# EAGLE design polarplotter allegro v4 (EAGLE 5.07)
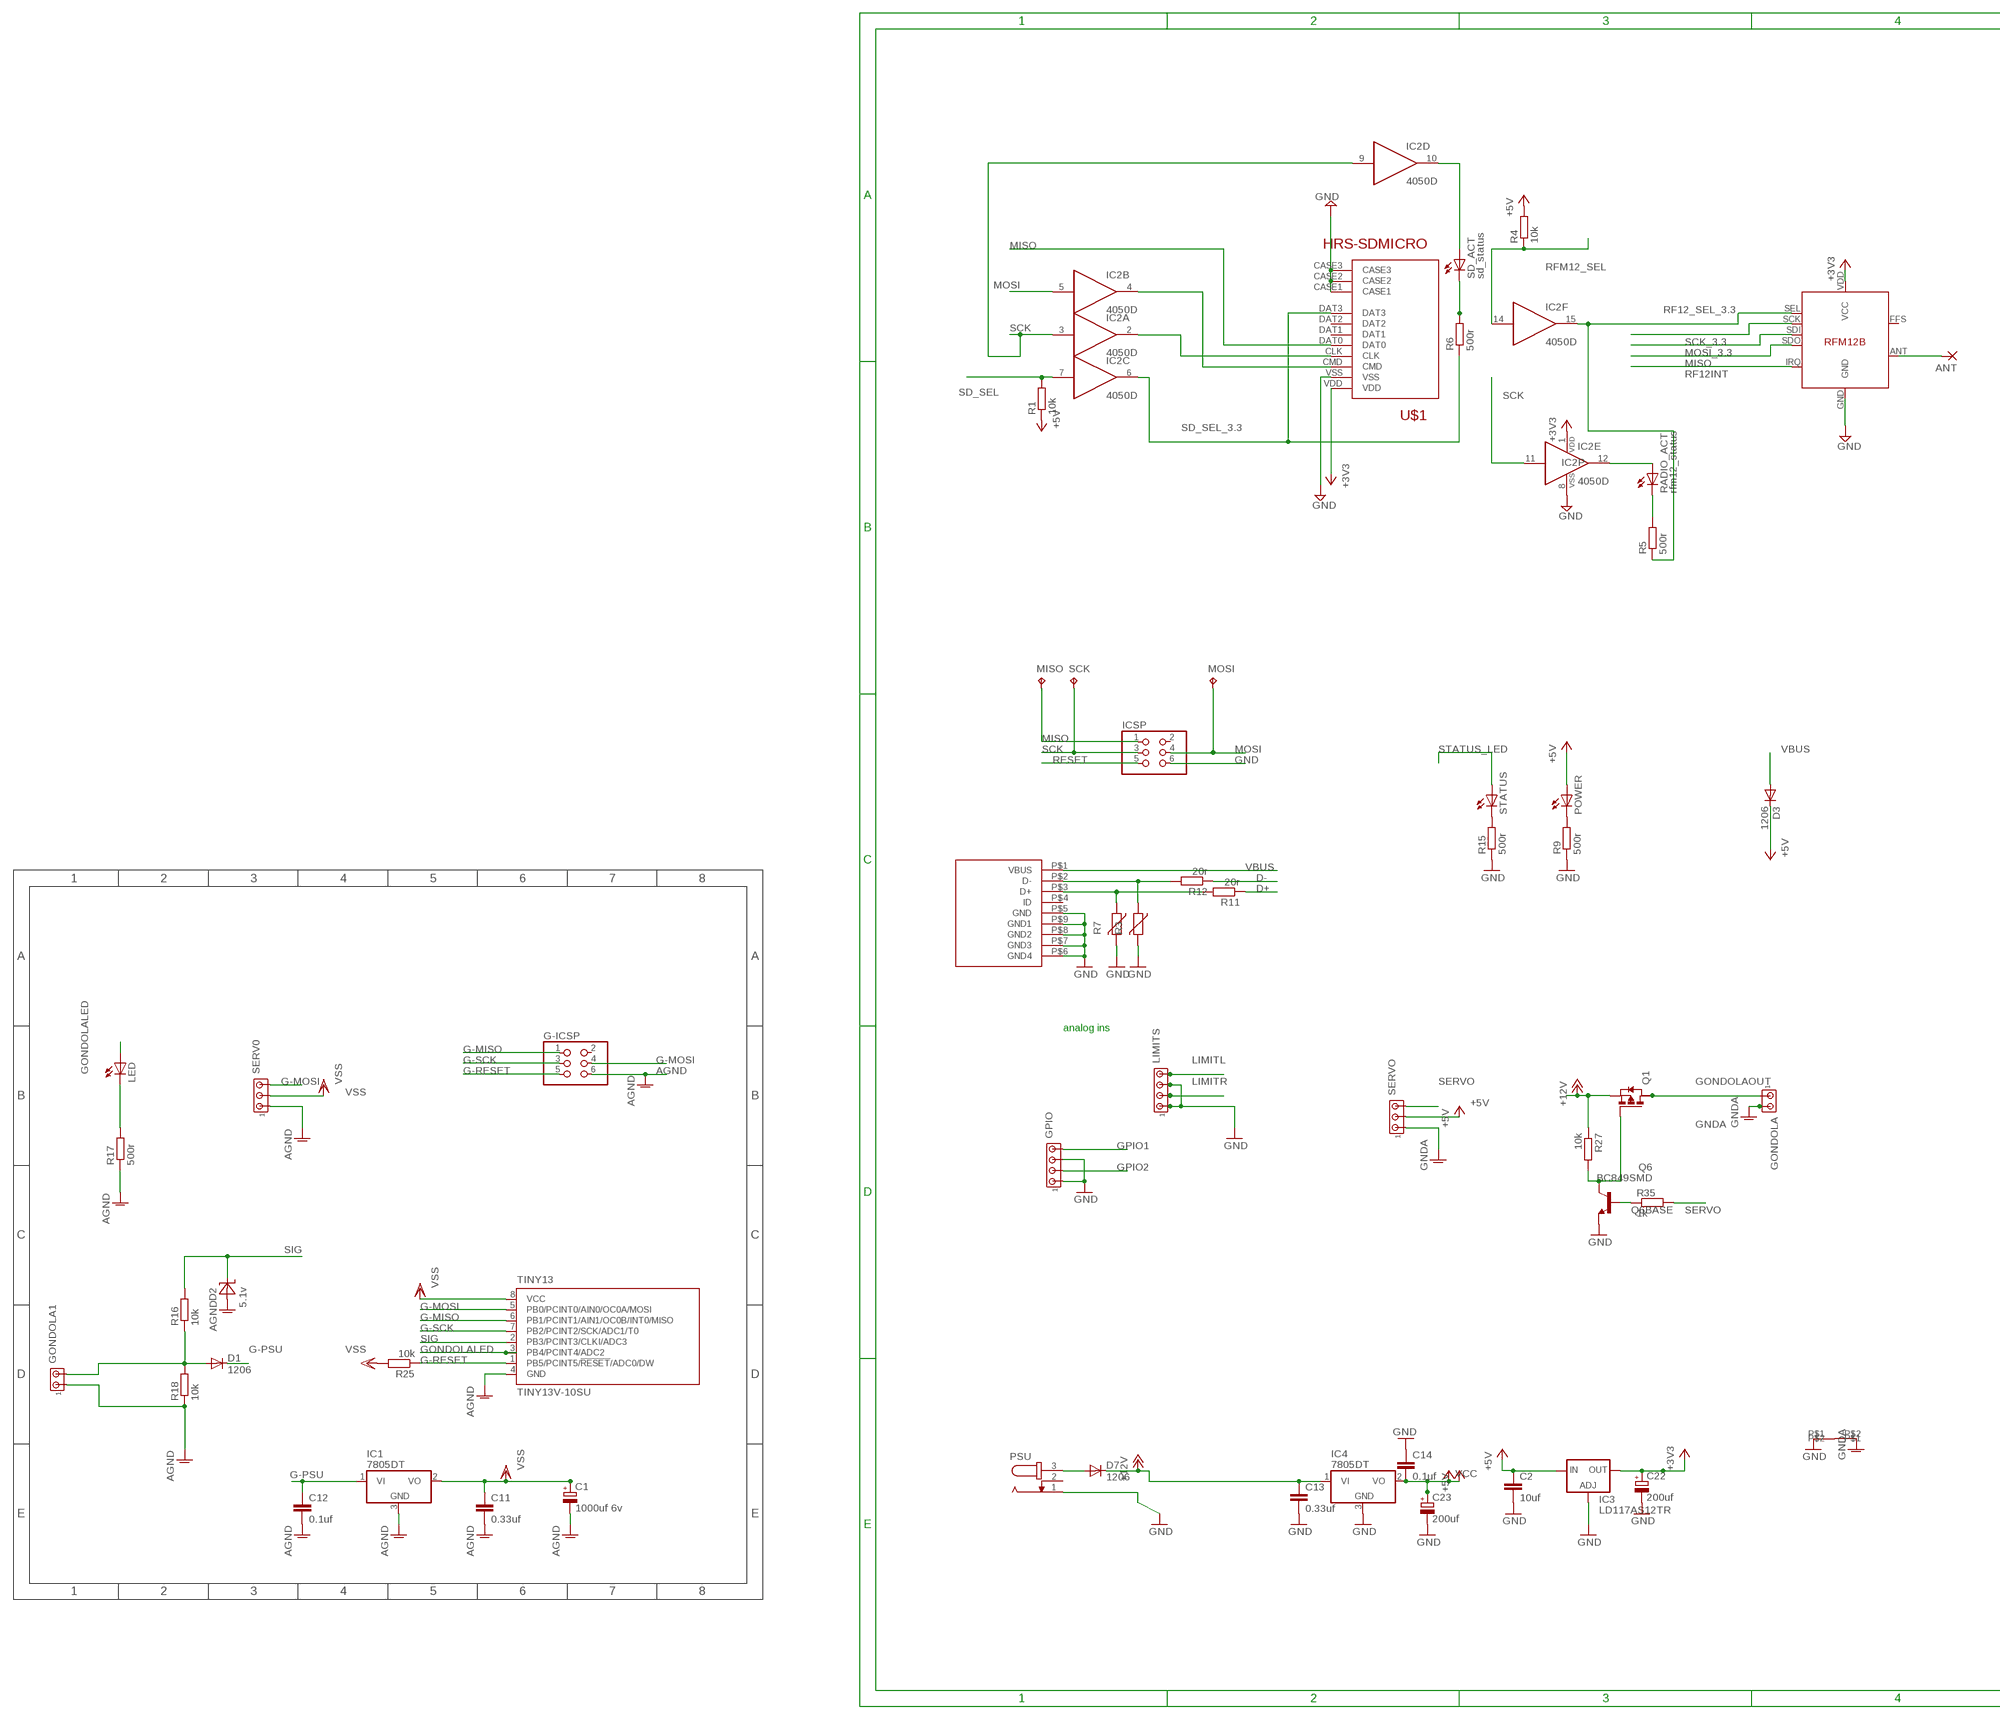
[diagram p0: schematic, sheet 1, part 1 of 2]
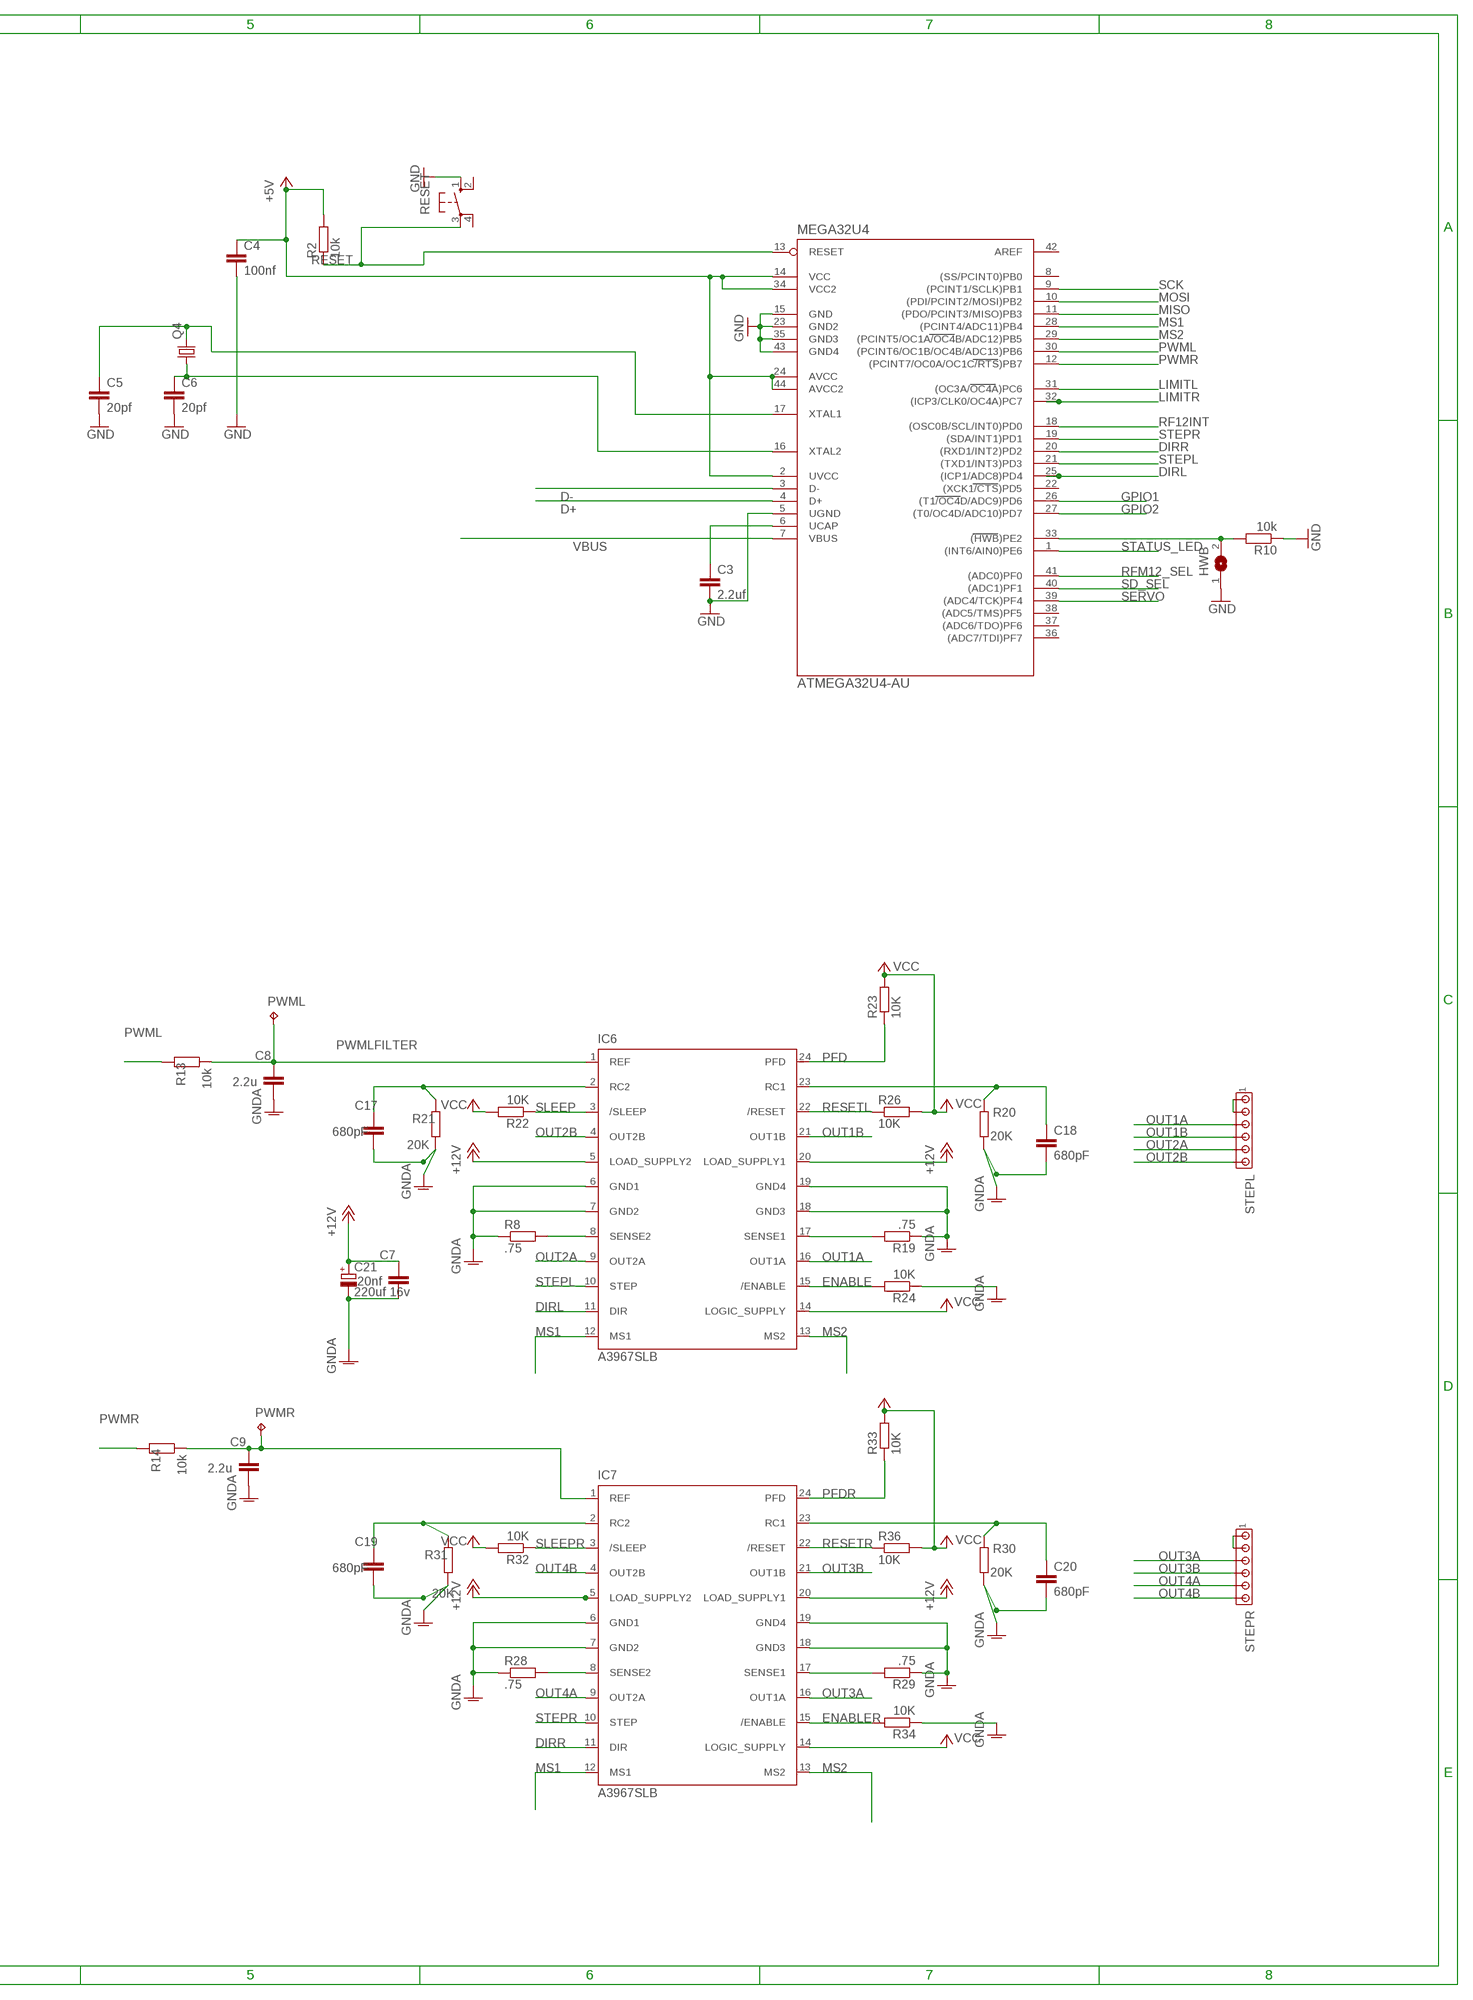
[diagram p1: schematic, sheet 1, part 2 of 2]

## Parts
ANT  1,6/0,8  [1,6/0,8]
C1  1000uf 6v  CPOL-EU153CLV-0810  [153CLV-0810]
C2  10uf  C-EUC1206  [C1206]
C3  2.2uf  C-EUC1206  [C1206]
C4  100nf  C-EUC1206  [C1206]
C5  20pf  C-EUC1206  [C1206]
C6  20pf  C-EUC1206  [C1206]
C7  20nf  C-EUC1206  [C1206]
C8  2.2u  C-EUC1206  [C1206]
C9  2.2u  C-EUC1206  [C1206]
C11  0.33uf  C-EUC1206  [C1206]
C12  0.1uf  C-EUC1206  [C1206]
C13  0.33uf  C-EUC1206  [C1206]
C14  0.1uf  C-EUC1206  [C1206]
C17  680pF  C-EUC1206  [C1206]
C18  680pF  C-EUC1206  [C1206]
C19  680pF  C-EUC1206  [C1206]
C20  680pF  C-EUC1206  [C1206]
C21  220uf 16v  CPOL-EU153CLV-0810  [153CLV-0810]
C22  200uf  CPOL-EU153CLV-0505  [153CLV-0505]
C23  200uf  CPOL-EU153CLV-0505  [153CLV-0505]
D1  1206  DIODE-GF1  [GF1]
D2  5.1v  1206ZENER  [C1206]
D3  1206  DIODE-GF1  [GF1]
D7  1206  DIODE-GF1  [GF1]
G-ICSP  PINHD-2X3  [2X03]
GONDOLA  MTA02-100  [10X02MTA]
GONDOLA1  MTA02-100  [10X02MTA]
GPIO  MTA04-100  [10X04MTA]
HWB  SJ  [SJ]
IC1  7805DT  [TO252]
IC2  4050D  [SO16]
IC3  LD117AS12TR  [SOT223]
IC4  7805DT  [TO252]
IC6  A3967SLB  [SO24W]
IC7  A3967SLB  [SO24W]
ICSP  PINHD-2X3  [2X03]
LED  LEDSMT1206  [1206]
LIMITS  MTA04-100  [10X04MTA]
MEGA32U4  ATMEGA32U4-AU  [TQFP44]
MISO  TPB1,27  [B1,27]
MOSI  TPB1,27  [B1,27]
POWER  LEDSMT1206  [1206]
PSU  JACK-PLUG1  [SPC4078]
PWML  TPB1,27  [B1,27]
PWMR  TPB1,27  [B1,27]
Q1  PMOSSOT223  [SOT223]
Q4  CRYSTALCTS406  [CTS406]
Q6  BC849SMD  [SOT23-BEC]
R1  10k  R-EU_R1206  [R1206]
R2  10k  R-EU_R1206  [R1206]
R3  VARISTORCN1206  [CT/CN1206]
R4  10k  R-EU_R1206  [R1206]
R5  500r  R-EU_R1206  [R1206]
R6  500r  R-EU_R1206  [R1206]
R7  VARISTORCN1206  [CT/CN1206]
R8  .75  R-EU_R1206  [R1206]
R9  500r  R-EU_R1206  [R1206]
R10  10k  R-EU_R1206  [R1206]
R11  20r  R-EU_R1206  [R1206]
R12  20r  R-EU_R1206  [R1206]
R13  10k  R-EU_R1206  [R1206]
R14  10k  R-EU_R1206  [R1206]
R15  500r  R-EU_R1206  [R1206]
R16  10k  R-EU_R1206  [R1206]
R17  500r  R-EU_R1206  [R1206]
R18  10k  R-EU_R1206  [R1206]
R19  .75  R-EU_R1206  [R1206]
R20  20K  R-EU_R1206  [R1206]
R21  20K  R-EU_R1206  [R1206]
R22  10K  R-EU_R1206  [R1206]
R23  10K  R-EU_R1206  [R1206]
R24  10K  R-EU_R1206  [R1206]
R25  10k  R-EU_R1206  [R1206]
R26  10K  R-EU_R1206  [R1206]
R27  10k  R-EU_M1206  [M1206]
R28  .75  R-EU_R1206  [R1206]
R29  .75  R-EU_R1206  [R1206]
R30  20K  R-EU_R1206  [R1206]
R31  20K  R-EU_R1206  [R1206]
R32  10K  R-EU_R1206  [R1206]
R33  10K  R-EU_R1206  [R1206]
R34  10K  R-EU_R1206  [R1206]
R35  1k  R-EU_M1206  [M1206]
R36  10K  R-EU_R1206  [R1206]
RADIO_ACT  rfm12_status  LEDSMT1206  [1206]
RESET  10-XX  [B3F-10XX]
RFM12  RFM12B  [RFM12B]
SCK  TPB1,27  [B1,27]
SD_ACT  sd_status  LEDSMT1206  [1206]
SERV0  MTA03-100  [10X03MTA]
SERVO  MTA03-100  [10X03MTA]
STATUS  LEDSMT1206  [1206]
STEPL  MTA06-100  [10X06MTA]
STEPR  MTA06-100  [10X06MTA]
TINY13  TINY13V-10SU  [8S2]
U$1  HRS-SDMICRO  [HRS-MICROSD]
U$4  SHORT  [SHORT]
USB  USB  [USB]

## Nets
+3V3: C22.+ IC2.1(P:VDD) IC3.4(OUT) RFM12.VDD(VCC) U$1.VDD
+5V: C2.1 C4.1 C14.2 C23.+ D3.C IC3.3(IN) IC4.2(VO) IC6.14(LOGIC_SUPPLY) IC7.14(LOGIC_SUPPLY) MEGA32U4.2(UVCC) MEGA32U4.14(VCC) MEGA32U4.24(AVCC) MEGA32U4.34(VCC2) MEGA32U4.44(AVCC2) POWER.A R1.1 R2.2 R4.2 R22.2 R23.2 R26.2 R32.2 R33.2 R36.2 SERVO.2 ; supply symbol labelled VCC
+12V [power]: C7.1 C13.1 C21.+ D7.C IC4.1(VI) IC6.5(LOAD_SUPPLY2) IC6.20(LOAD_SUPPLY1) IC7.5(LOAD_SUPPLY2) IC7.20(LOAD_SUPPLY1) Q1.3(S) R27.1
AGND [power]: C1.- C11.2 C12.2 D2.ANODE(A) G-ICSP.6 GONDOLA1.1 IC1.3(GND) R17.1 R18.1 SERV0.1 TINY13.4(GND)
D+: MEGA32U4.4(D+) R11.1
D-: MEGA32U4.3(D-) R12.1
DIRL: IC6.11(DIR) MEGA32U4.25((ICP1/ADC8)PD4)
DIRR: IC7.11(DIR) MEGA32U4.20((RXD1/INT2)PD2)
ENABLE: IC6.15(/ENABLE) R24.2
ENABLER: IC7.15(/ENABLE) R34.2
G-MISO: G-ICSP.1 TINY13.6(PB1/PCINT1/AIN1/OC0B/INT0/MISO)
G-MOSI: G-ICSP.4 SERV0.3 TINY13.5(PB0/PCINT0/AIN0/OC0A/MOSI)
G-PSU: C12.1 D1.C IC1.1(VI)
G-RESET: G-ICSP.5 R25.1 TINY13.1(PB5/PCINT5/!RESET!/ADC0/DW)
G-SCK: G-ICSP.3 TINY13.7(PB2/PCINT2/SCK/ADC1/T0)
GND [power]: C2.2 C3.2 C4.2 C5.2 C6.2 C13.2 C14.1 C22.- C23.- GPIO.1 GPIO.3 HWB.1 IC2.8(P:VSS) IC3.1(ADJ) IC4.3(GND) ICSP.6 LIMITS.1 LIMITS.3 MEGA32U4.5(UGND) MEGA32U4.15(GND) MEGA32U4.23(GND2) MEGA32U4.35(GND3) MEGA32U4.43(GND4) PSU.1 Q6.E R3.2 R7.2 R9.1 R10.1 R15.1 RESET.1(S) RFM12.GND U$1.CASE1 U$1.CASE2 U$1.CASE3 U$1.VSS U$4.P$1 USB.P$5(GND) USB.P$6(GND4) USB.P$7(GND3) USB.P$8(GND2) USB.P$9(GND1)
GNDA [power]: C7.2 C8.2 C9.2 C17.2 C18.2 C19.2 C20.2 C21.- GONDOLA.2 IC6.6(GND1) IC6.7(GND2) IC6.18(GND3) IC6.19(GND4) IC7.6(GND1) IC7.7(GND2) IC7.18(GND3) IC7.19(GND4) R8.1 R19.1 R20.1 R21.1 R24.1 R28.1 R29.1 R30.1 R31.1 R34.1 SERVO.1 U$4.P$2
GONDOLALED: LED.A TINY13.3(PB4/PCINT4/ADC2)
GONDOLAOUT [power]: GONDOLA.1 Q1.2(D)
GPIO1: GPIO.4 MEGA32U4.26((T1/OC4D/ADC9)PD6)
GPIO2: GPIO.2 MEGA32U4.27((T0/OC4D/ADC10)PD7)
LIMITL: LIMITS.4 MEGA32U4.31((OC3A/OC4A)PC6)
LIMITR: LIMITS.2 MEGA32U4.32((ICP3/CLK0/OC4A)PC7)
MISO: ICSP.1 MEGA32U4.11((PDO/PCINT3/MISO)PB3) MISO.TP RFM12.SDO U$1.DAT0
MOSI: IC2.5(B:I) ICSP.4 MEGA32U4.10((PDI/PCINT2/MOSI)PB2) MOSI.TP
MOSI_3.3: IC2.4(B:O) RFM12.SDI U$1.CMD
MOTORSUPPLY [power]: STEPL.5 STEPL.6
MOTORSUPPLY1 [power]: STEPR.5 STEPR.6
MS1: IC6.12(MS1) IC7.12(MS1) MEGA32U4.28((PCINT4/ADC11)PB4)
MS2: IC6.13(MS2) IC7.13(MS2) MEGA32U4.29((PCINT5/OC1A/OC4B/ADC12)PB5)
N$1: HWB.2 MEGA32U4.33((HWB)PE2) R10.2
N$3: IC2.12(E:O) RADIO_ACT.A
N$4: D1.A GONDOLA1.2 R16.1 R18.2
N$5: IC2.10(D:O) SD_ACT.A
N$6: R3.1 R12.2 USB.P$2(D-)
N$7: R15.2 STATUS.C
N$8: C3.1 MEGA32U4.6(UCAP)
N$9: ANT.1(P) RFM12.ANT
N$10: C6.1 MEGA32U4.16(XTAL2) Q4.1
N$11: C5.1 MEGA32U4.17(XTAL1) Q4.3
N$12: R7.1 R11.2 USB.P$3(D+)
N$13: POWER.C R9.2
N$14: D7.A PSU.3
N$15: R5.2 RADIO_ACT.C
N$18: R6.2 SD_ACT.C
N$22: IC6.8(SENSE2) R8.2
N$23: IC6.17(SENSE1) R19.2
N$24: C17.1 IC6.2(RC2) R21.2
N$25: C18.1 IC6.23(RC1) R20.2
N$26: IC7.8(SENSE2) R28.2
N$27: IC7.17(SENSE1) R29.2
N$28: C19.1 IC7.2(RC2) R31.2
N$29: C20.1 IC7.23(RC1) R30.2
N$34: LED.C R17.2
OUT1A: IC6.16(OUT1A) STEPL.4
OUT1B: IC6.21(OUT1B) STEPL.3
OUT2A: IC6.9(OUT2A) STEPL.2
OUT2B: IC6.4(OUT2B) STEPL.1
OUT3A: IC7.16(OUT1A) STEPR.4
OUT3B: IC7.21(OUT1B) STEPR.3
OUT4A: IC7.9(OUT2A) STEPR.2
OUT4B: IC7.4(OUT2B) STEPR.1
PFD: IC6.24(PFD) R23.1
PFDR: IC7.24(PFD) R33.1
PWML: MEGA32U4.30((PCINT6/OC1B/OC4B/ADC13)PB6) R13.2
PWMLFILTER: C8.1 IC6.1(REF) PWML.TP R13.1
PWMR: MEGA32U4.12((PCINT7/OC0A/OC1C/RTS)PB7) R14.2
PWMRFILTER: C9.1 IC7.1(REF) PWMR.TP R14.1
Q6BASE: Q6.B R35.1
Q6COLLECTOR: Q1.1(G) Q6.C R27.2
RESET: ICSP.5 MEGA32U4.13(RESET) R2.1 RESET.3(P)
RESETL: IC6.22(/RESET) R26.1
RESETR: IC7.22(/RESET) R36.1
RF12_SEL_3.3: IC2.15(F:O) R5.1 RFM12.SEL
RF12INT: MEGA32U4.18((OSC0B/SCL/INT0)PD0) RFM12.IRQ
RFM12_SEL: IC2.14(F:I) MEGA32U4.41((ADC0)PF0) R4.1
SCK: IC2.3(A:I) IC2.9(D:I) IC2.11(E:I) ICSP.3 MEGA32U4.9((PCINT1/SCLK)PB1) SCK.TP
SCK_3.3: IC2.2(A:O) RFM12.SCK U$1.CLK
SD_SEL: IC2.7(C:I) MEGA32U4.40((ADC1)PF1) R1.2
SD_SEL_3.3: IC2.6(C:O) R6.1 U$1.DAT3
SERVO: MEGA32U4.39((ADC4/TCK)PF4) R35.2 SERVO.3
SIG: D2.CATHODE(C) R16.2 TINY13.2(PB3/PCINT3/CLKI/ADC3)
SLEEP: IC6.3(/SLEEP) R22.1
SLEEPR: IC7.3(/SLEEP) R32.1
STATUS_LED: MEGA32U4.1((INT6/AIN0)PE6) STATUS.A
STEPL: IC6.10(STEP) MEGA32U4.21((TXD1/INT3)PD3)
STEPR: IC7.10(STEP) MEGA32U4.19((SDA/INT1)PD1)
VBUS [power]: D3.A MEGA32U4.7(VBUS) USB.P$1(VBUS)
VSS: C1.+ C11.1 IC1.2(VO) R25.2 SERV0.2 TINY13.8(VCC)
Unconnected: G-ICSP.2 ICSP.2 MEGA32U4.8((SS/PCINT0)PB0) MEGA32U4.22((XCK1/CTS)PD5) MEGA32U4.36((ADC7/TDI)PF7) MEGA32U4.37((ADC6/TDO)PF6) MEGA32U4.38((ADC5/TMS)PF5) MEGA32U4.42(AREF) PSU.2 Q1.4(D2) RESET.2(S1) RESET.4(P1) RFM12.FFS U$1.DAT1 U$1.DAT2 USB.P$4(ID)

## Notes on the sheet
- analog ins

## Library data of the parts
ANT = JeeLabs:1,6/0,8: THROUGH-HOLE PAD
C1 C21 = matt rcl:CPOL-EU: POLARIZED CAPACITOR, European symbol
C2 C7-C9 C11-C14 C17-C20 = resistor:C-EU: CAPACITOR, European symbol
C3-C6 = matt rcl:C-EU: CAPACITOR, European symbol
C22 C23 = rcl:CPOL-EU: POLARIZED CAPACITOR, European symbol
D1 D3 D7 = matt diode:DIODE-: DIODE
D2 = matt diode:1206ZENER
G-ICSP ICSP = pinhead:PINHD-2X3: PIN HEADER
GONDOLA GONDOLA1 = matt con-amp:MTA02-100: AMP connector
GPIO LIMITS = matt con-amp:MTA04-100: AMP connector
HWB = jumper:SJ: SMD solder JUMPER
IC1 IC4 = linear:78*: Positive VOLTAGE REGULATOR Source: http://cache.national.com/ds/LM/LM78L05.pdf http://www.fairchildsemi.com/ds/LM/LM7805.pdf
IC2 = 40xx:4050: Hex non-inverting BUFFER
IC3 = v-reg:LD117A?*: Low drop fixed and adjustable positive voltage regulators 1 A Source: http://www.st.com/stonline/products/literature/ds/7194/ld1117axx.pdf
IC6 IC7 = Allegro:A3967SLB: ANALOG DEVICES
LED POWER RADIO_ACT SD_ACT STATUS = matt led:LED: LED OSRAM: - CHIPLED LG R971, LG N971, LY N971, LG Q971, LY Q971, LO R971, LY R971 LH N974, LH R974 LS Q976, LO Q976, LY Q976 LO Q996 - Hyper CHIPLED LW Q18S LB Q993, LB Q99A, LB R99A - SideLED LS A670, LO A670, LY A670, LG A670, LP A670 LB A673, LV A673, LT A673, LW A673 LH A674 LY A675 LS A676, LA A676, LO A676, LY A676, LW A676 LS A679, LY A679, LG A679 - Hyper Micro SIDELED® LS Y876, LA Y876, LO Y876, LY Y876 LT Y87S - SmartLED LW L88C, LW L88S LB L89C, LB L89S, LG L890 LS L89K, LO L89K, LY L89K LS L896, LA L896, LO L896, LY L896 - TOPLED LS T670, LO T670, LY T670, LG T670, LP T670 LSG T670, LSP T670, LSY T670, LOP T670, LYG T670 LG T671, LOG T671, LSG T671 LB T673, LV T673, LT T673, LW T673 LH T674 LS T676, LA T676, LO T676, LY T676, LB T676, LH T676, LSB T676, LW T676 LB T67C, LV T67C, LT T67C, LS T67K, LO T67K, LY T67K, LW E67C LS E67B, LA E67B, LO E67B, LY E67B, LB E67C, LV E67C, LT E67C LW T67C LS T679, LY T679, LG T679 LS T770, LO T770, LY T770, LG T770, LP T770 LB T773, LV T773, LT T773, LW T773 LH T774 LS E675, LA E675, LY E675, LS T675 LS T776, LA T776, LO T776, LY T776, LB T776 LHGB T686 LT T68C, LB T68C - Hyper Mini TOPLED® LB M676 - Mini TOPLED Santana® LG M470 LS M47K, LO M47K, LY M47K Source: http://www.osram.convergy.de LUXEON: - LUMILED® LXK2-PW12-R00, LXK2-PW12-S00, LXK2-PW14-U00, LXK2-PW14-V00 LXK2-PM12-R00, LXK2-PM12-S00, LXK2-PM14-U00 LXK2-PE12-Q00, LXK2-PE12-R00, LXK2-PE12-S00, LXK2-PE14-T00, LXK2-PE14-U00 LXK2-PB12-K00, LXK2-PB12-L00, LXK2-PB12-M00, LXK2-PB14-N00, LXK2-PB14-P00, LXK2-PB14-Q00 LXK2-PR12-L00, LXK2-PR12-M00, LXK2-PR14-Q00, LXK2-PR14-R00 LXK2-PD12-Q00, LXK2-PD12-R00, LXK2-PD12-S00 LXK2-PH12-R00, LXK2-PH12-S00 LXK2-PL12-P00, LXK2-PL12-Q00, LXK2-PL12-R00 Source: www.luxeon.com KINGBRIGHT: KA-3528ASYC Source: www.kingbright.com
MEGA32U4 = mega32U4:ATMEGA32U4-AU
MISO MOSI PWML PWMR SCK = testpad:TP: Test pad
PSU = con-jack:JACK-PLUG: DC POWER JACK Power Jack, DC, Right Angle, Through Hole, Rated 5A at 16VDC, PC Terminals Distributor: Farnell (www.Farnell.de) Drawing: 84N1161.pdf / 84N1162.pdf Manufacturer: SPC Technology (www.spctechnology.com) Type: SPC4077 / SPC 4078
Q1 = zetex:PMOSSOT223: MOS FET
Q4 = crystal:CRYSTAL: CRYSTAL
Q6 = matt transistor-npn:BC849*: NPN Transistor
R1 R2 R4-R6 R9-R12 R15-R18 R25 = matt rcl:R-EU_: RESISTOR, European symbol
R3 R7 = varistor:VARISTOR: VARISTOR
R8 R13 R14 R19-R24 R26 R28-R34 R36 = rcl:R-EU_: RESISTOR, European symbol
R27 R35 = resistor:R-EU_: RESISTOR, European symbol
RESET = switch-omron:10-XX: OMRON SWITCH
RFM12 = lh-library:RFM12B
SERV0 SERVO = matt con-amp:MTA03-100: AMP connector
STEPL STEPR = matt con-amp:MTA06-100: AMP connector
TINY13 = atmel:TINY13: 8-bit AVR Microcontroller with 1K Bytes In-System Programmable Flash Source: http://www.atmel.com/dyn/resources/prod_documents/2535S.pdf; MPN: ATTINY13V-10SU; OC_FARNELL: 9171584; OC_NEWARK: 96K6524
U$1 = matt:HRS-SDMICRO
U$4 = matt:SHORT
USB = matt:USB

## Net classes
1 power: width 3 mm
2 medpower: width 1 mm

## Board
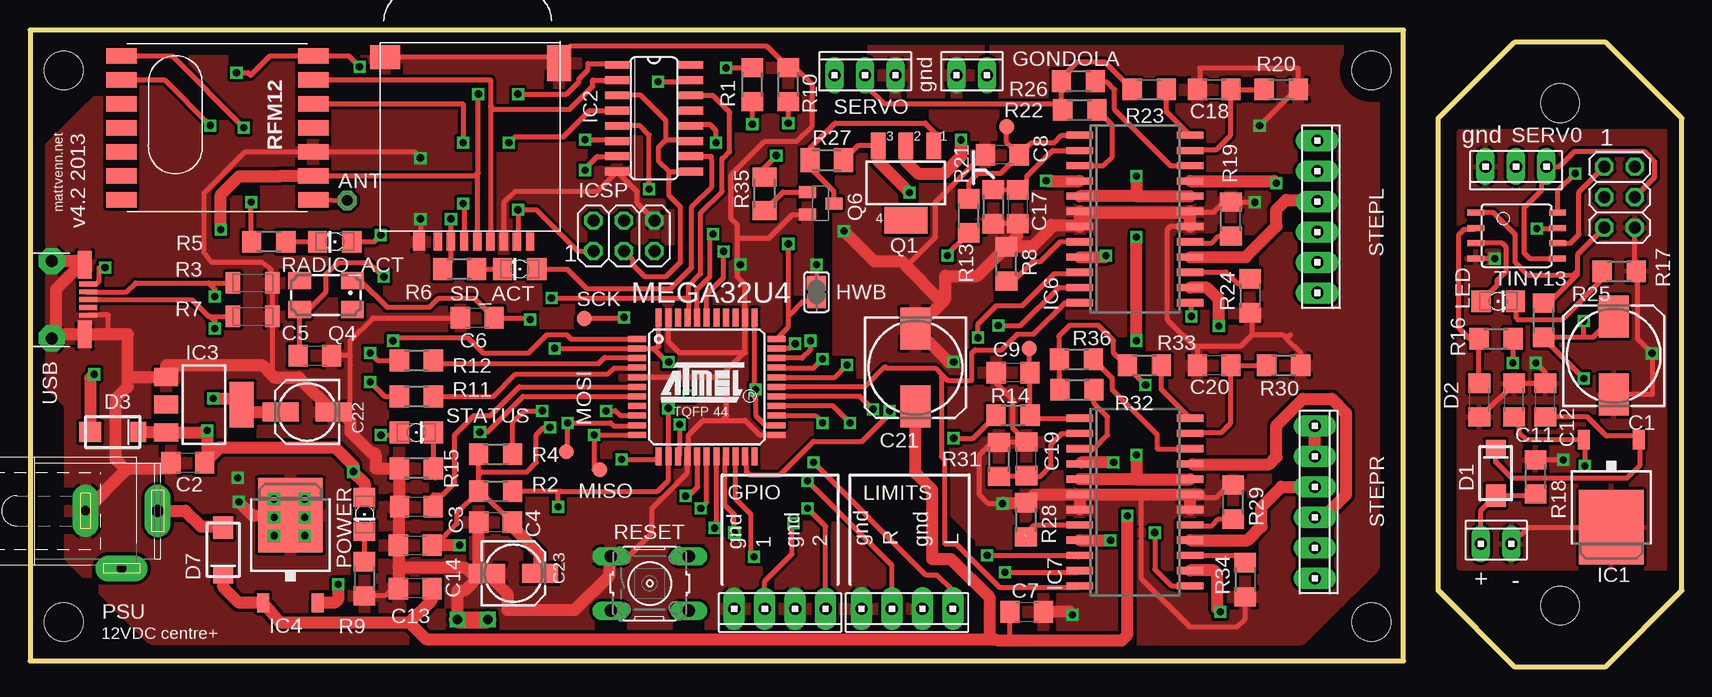
[diagram p2: board, top side]
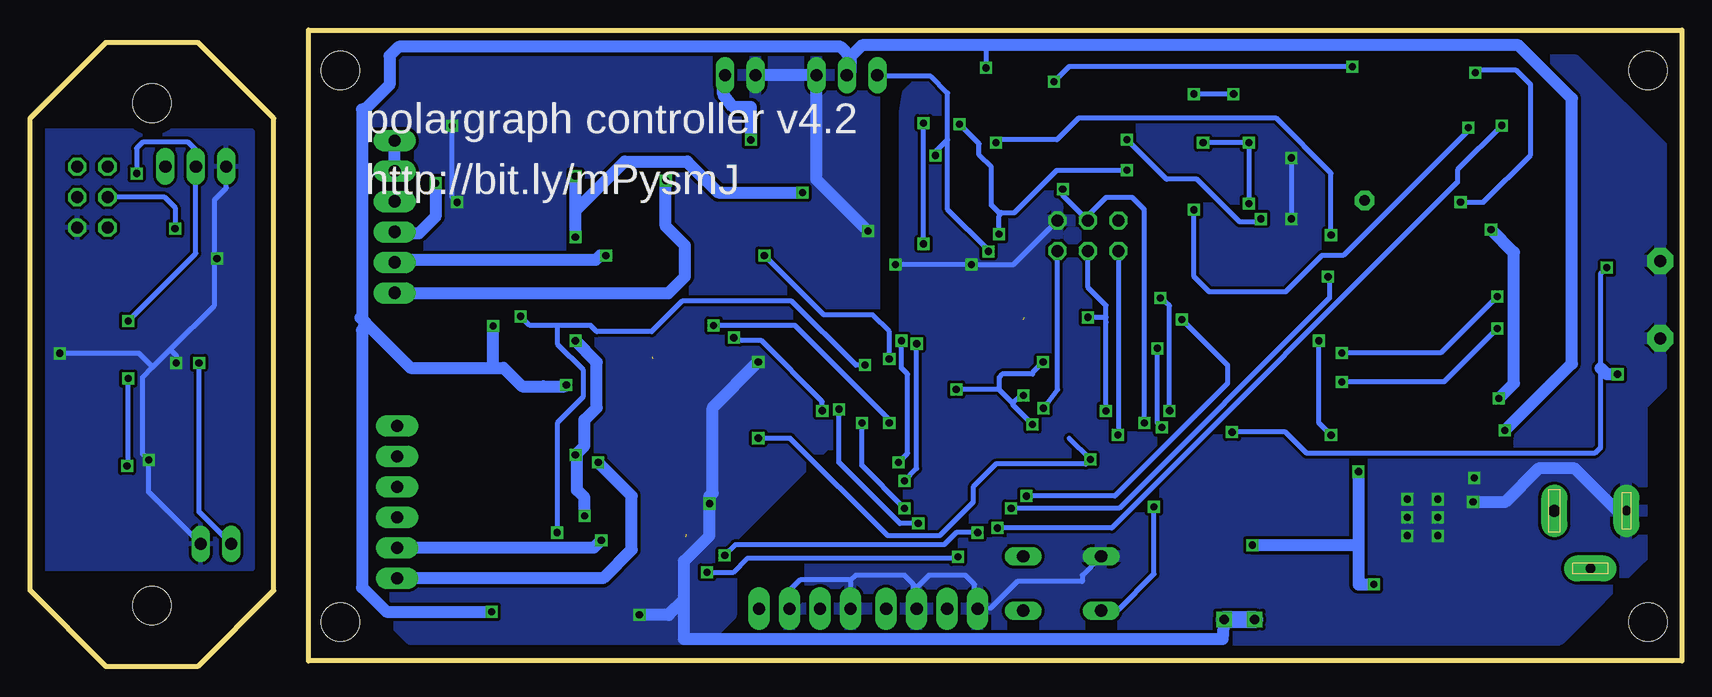
[diagram p3: board, bottom side, seen from below]

Size 137.7 x 53.09 mm. Coordinates in mm from the lower left corner, seen from the top.
Outline: 0,0.48 114.49,0.48 114.49,53.09 0,53.09 0,0.48
Outline: 117.38,45.72 123.73,52.07 131.35,52.07 137.7,45.72 137.7,6.35 131.35,0 123.73,0 117.38,6.35 117.38,45.72
Copper layers (1*16): Top 0.035mm / dielectric 1.5mm / Bottom 0.035mm
Design rules "default *": minimum track width 10mil, minimum drill 24mil, track to track 8mil, track to pad 8mil, pad to pad 8mil, via to via 8mil, smd to smd 8mil, copper to edge 40mil, drill to drill 8mil, minimum pad ring 10mil, minimum via ring 8mil, stop-mask expansion 4mil, vias tented up to drill 25mil, thermal gap 10mil
Holes 3.2 mm at 2.81,49.73 2.81,3.73 111.81,3.73 111.81,49.73 127.54,46.99 127.54,5.08

### Footprints (pad centres in the part's own frame; a part is rotated, then mirrored left to right if it is on the bottom)
1,6/0,8 = drill 0.9 pad 1.6 octagon: 1 0,0
153CLV-0810 = smd 3.5 x 2.5: + 3.25,0; - -3.25,0
C1206 = smd 1.6 x 1.8: 1 -1.4,0; 2 1.4,0
153CLV-0505 = smd 3 x 1.6: + 2.2,0; - -2.2,0
GF1 = smd 1.85 x 1.68: A 1.87,0 | smd 1.32 x 1.68: C -2.12,0
C1206' = smd 1.6 x 1.8: ANODE -1.4,0; CATHODE 1.4,0
2X03 = drill 1.016 octagon: 1 -2.54,-1.27; 2 -2.54,1.27; 3 0,-1.27; 4 0,1.27; 5 2.54,-1.27; 6 2.54,1.27
10X02MTA = drill 1.016 long: 1 1.27,0; 2 -1.27,0
10X04MTA = drill 1.016 pad 1.778 long: 1 3.81,0; 2 1.27,0; 3 -1.27,0; 4 -3.81,0
SJ = smd 1.168 x 1.6: 1 -0.762,0; 2 0.762,0
TO252 = smd 1 x 1.6: 1 -2.28,-4.8; 2 2.28,-4.8 | smd 5.4 x 6.2: 3 0,2.5
SO16 = smd 0.66 x 2.032: 1 -4.445,-3.073; 2 -3.175,-3.073; 3 -1.905,-3.073; 4 -0.635,-3.073; 5 0.635,-3.073; 6 1.905,-3.073; 7 3.175,-3.073; 8 4.445,-3.073; 9 4.445,3.073; 10 3.175,3.073; 11 1.905,3.073; 12 0.635,3.073; 13 -0.635,3.073; 14 -1.905,3.073; 15 -3.175,3.073; 16 -4.445,3.073
SOT223 = smd 1.5 x 2: 1 -2.3,-3.15; 2 0,-3.15; 3 2.3,-3.15 | smd 3.8 x 2: 4 0,3.15
SO24W = smd 0.6 x 2.2: 1 -6.985,-4.6; 2 -5.715,-4.6; 3 -4.445,-4.6; 4 -3.175,-4.6; 5 -1.905,-4.6; 6 -0.635,-4.6; 7 0.635,-4.6; 8 1.905,-4.6; 9 3.175,-4.6; 10 4.445,-4.6; 11 5.715,-4.6; 12 6.985,-4.6; 13 6.985,4.6; 14 5.715,4.6; 15 4.445,4.6; 16 3.175,4.6; 17 1.905,4.6; 18 0.635,4.6; 19 -0.635,4.6; 20 -1.905,4.6; 21 -3.175,4.6; 22 -4.445,4.6; 23 -5.715,4.6; 24 -6.985,4.6
1206 = smd 1.6 x 1.803: A -1.422,0; C 1.422,0
TQFP44 = smd 1.5 x 0.5: 1 -5.8,4; 2 -5.8,3.2; 3 -5.8,2.4; 4 -5.8,1.6; 5 -5.8,0.8; 6 -5.8,0; 7 -5.8,-0.8; 8 -5.8,-1.6; 9 -5.8,-2.4; 10 -5.8,-3.2; 11 -5.8,-4; 23 5.8,-4; 24 5.8,-3.2; 25 5.8,-2.4; 26 5.8,-1.6; 27 5.8,-0.8; 28 5.8,0; 29 5.8,0.8; 30 5.8,1.6; 31 5.8,2.4; 32 5.8,3.2; 33 5.8,4 | smd 0.5 x 1.5: 12 -4,-5.8; 13 -3.2,-5.8; 14 -2.4,-5.8; 15 -1.6,-5.8; 16 -0.8,-5.8; 17 0,-5.8; 18 0.8,-5.8; 19 1.6,-5.8; 20 2.4,-5.8; 21 3.2,-5.8; 22 4,-5.8; 34 4,5.8; 35 3.2,5.8; 36 2.4,5.8; 37 1.6,5.8; 38 0.8,5.8; 39 0,5.8; 40 -0.8,5.8; 41 -1.6,5.8; 42 -2.4,5.8; 43 -3.2,5.8; 44 -4,5.8
B1,27 = smd 1.27 x 1.27: TP 0,0
SPC4078 = drill 0.8 pad 2.184 long: 1 -3,0; 2 0,-4.8 | drill 1 pad 2.184 long: 3 3,0
SOT223' = smd 1.219 x 2.235: 1 -2.311,-3.099; 2 0,-3.099; 3 2.311,-3.099 | smd 3.6 x 2.2: 4 0,3.099
CTS406 = smd 1.9 x 1.4: 1 -2.2,-1.2; 2 2.2,-1.2; 3 2.2,1.2; 4 -2.2,1.2
SOT23-BEC = smd 1 x 1.4: B -0.95,-1.1; C 0,1.1; E 0.95,-1.1
R1206 = smd 1.6 x 1.803: 1 -1.422,0; 2 1.422,0
CT/CN1206 = smd 1.2 x 1.8: 1 -1.65,0; 2 1.65,0
M1206 = smd 1.6 x 2: 1 -1.4,0; 2 1.4,0
B3F-10XX = drill 1.016 long: 1 -3.251,2.261; 2 3.251,2.261; 3 -3.251,-2.261; 4 3.251,-2.261
RFM12B = smd 2.54 x 1.27: ANT 8,-6; FFS -8,2; GND 8,-2; IRQ -8,4; P$8 -8,0; P$9 -8,-2; P$10 -8,-4; P$12 -8,-6; P$16 8,0; SCK 8,4; SDI 8,2; SDO -8,6; SEL 8,6; VDD 8,-4
10X03MTA = drill 1.016 long: 1 2.54,0; 2 0,0; 3 -2.54,0
10X06MTA = drill 1.016 pad 1.778 long: 1 6.35,0; 2 3.81,0; 3 1.27,0; 4 -1.27,0; 5 -3.81,0; 6 -6.35,0
8S2 = smd 0.5 x 1.4: 1 -1.905,-3.404; 2 -0.645,-3.404; 3 0.625,-3.404; 4 1.895,-3.404; 5 1.905,3.404; 6 0.635,3.404; 7 -0.635,3.404; 8 -1.905,3.404
HRS-MICROSD = smd 1 x 1.5: CASE1 5.95,1.9 | smd 2 x 3: CASE2 -5.7,-13 | smd 2.5 x 2: CASE3 8.8,-13.5 | smd 0.7 x 1.5: CLK 0,1.9; CMD 2.2,1.9; DAT0 -2.2,1.9; DAT1 -3.3,1.9; DAT2 4.4,1.9; DAT3 3.3,1.9; VDD 1.1,1.9; VSS -1.1,1.9
SHORT = drill 0.8 square: P$1 -2.54,0; P$2 0,0
USB = smd 0.4 x 1.5: P$1 -1.3,4.125; P$2 -0.65,4.125; P$3 0,4.125; P$4 0.65,4.125; P$5 1.3,4.125 | smd 2.3 x 1.2: P$6 2.9,3.85; P$7 -2.9,3.85 | drill 1 pad 2.184 octagon: P$8 3.225,1.1; P$9 -3.225,1.1

### Placement (x,y rotation side)
ANT  26.45,38.88 0 top
C1  132.01,25.93 90 top
C2  13.16,17 180 top
C3  32.21,13.33 180 top
C4  38.81,12.04 180 top
C5  23.75,25.94 0 top
C6  37.28,29.08 180 top
C7  83.09,4.57 0 top
C8  81.06,42.67 180 top
C9  81.95,24.51 180 top
C11  123.71,22.23 90 top
C12  126.31,22.23 90 top
C13  32.11,6.52 180 top
C14  32.11,10.13 0 top
C17  82.33,38.35 270 top
C18  98.7,48.12 180 top
C19  83.06,17.33 90 top
C20  98.7,25.12 180 top
C21  73.81,24.93 270 top
C22  23.1,21.23 180 top
C23  40.31,7.78 0 top
D1  122.18,16.13 270 top
D2  5.1v  [C1206']  120.81,22.23 90 top
D3  6.89,19.56 180 top
D7  16.11,9.73 90 top
G-ICSP  132.5,39.15 270 top
GONDOLA  78.5,49.33 0 top
GONDOLA1  122.21,10.23 0 top
GPIO  62.52,4.83 180 top
HWB  65.56,31.24 270 top
IC1  131.81,14.13 180 top
IC2  52.01,45.73 270 top
IC3  14.51,21.84 270 top
IC4  21.71,10.13 0 top
IC6  92.1,37.32 270 top
IC7  92.1,13.72 270 top
ICSP  49.51,35.93 0 top
LED  122.39,30.48 0 top
LIMITS  73.11,4.83 180 top
MEGA32U4  56.41,23.33 0 top
MISO  47.51,16.43 0 top
MOSI  44.71,17.93 0 top
POWER  27.88,12.7 270 top
PSU  7.63,12.99 0 top
PWML  81.41,45.03 0 top
PWMR  83.31,26.53 0 top
Q1  [SOT223']  73.01,40.33 180 top
Q4  24.67,30.99 180 top
Q6  65.91,38.63 270 top
R1  60.21,48.53 270 top
R2  38.81,14.63 180 top
R3  18.57,32 0 top
R4  38.81,17.73 180 top
R5  19.91,35.43 0 top
R6  35.81,33.15 0 top
R7  18.57,29.21 0 top
R8  81.39,33.58 270 top
R9  27.88,7.33 90 top
R10  63.21,48.53 270 top
R11  32.21,22.53 180 top
R12  32.21,25.53 180 top
R13  78.26,37.59 270 top
R14  81.95,20.96 180 top
R15  32.21,16.53 0 top
R16  122.21,27.33 180 top
R17  132.46,32.98 180 top
R18  125.5,15.82 270 top
R19  100.1,37.32 270 top
R20  104.3,48.12 180 top
R21  80.3,38.35 90 top
R22  87.51,46.43 180 top
R23  93.3,48.12 180 top
R24  101.7,30.92 90 top
R25  126.18,28.9 270 top
R26  87.4,48.82 180 top
R27  66.41,42.23 180 top
R28  83.02,12.25 270 top
R29  100.3,13.72 270 top
R30  104.5,25.12 180 top
R31  80.77,17.27 270 top
R32  87.27,23.09 180 top
R33  92.9,25.12 180 top
R34  101.3,7.25 90 top
R35  61.21,39.43 90 top
R36  87.23,25.63 180 top
RADIO_ACT  25.41,35.43 180 top
RESET  51.66,6.93 0 top
RFM12  15.61,44.93 0 top
SCK  46.21,29.03 0 top
SD_ACT  40.83,33.15 180 top
SERV0  123.87,41.71 180 top
SERVO  69.61,49.33 0 top
STATUS  32.21,19.53 0 top
STEPL  107.3,37.52 270 top
STEPR  107.1,13.72 270 top
TINY13  123.93,35.94 270 top
U$1  38.39,37.34 180 top
U$2  [OPENHARDWARELOGO]  100.59,3.51 0 bottom
U$4  38.16,3.92 0 top
U$5  [OPENHWLOGOSMALL]  132.26,9.25 0 bottom
USB  0.71,30.61 270 top

### Tracks (layer width: path | path; a pad name or v marks a point on that pad's centre or on a via)
+3V3  (via drill 0.6)
  Top 0.406: 20.41,40.93 20.86,40.93 20.82,40.89 | 17.15,22.35 IC3.4 | RFM12.VDD 37.12,40.93 | 37.12,40.93 37.29,40.93 U$1.VDD | v37.37,47.75 37.37,41.18 37.12,40.93 | IC2.1 48.82,50.29 46.51,50.29 46.51,49.78 45.75,49.02 45.75,48.77 44.74,47.75 v40.67,47.75
  Top 1.016: 20.86,40.93 RFM12.VDD | 20.82,40.89 17.43,40.89 15.91,39.37 v15.91,36.45 | v15.27,22.35 17.15,22.35 | C22.+ 18.27,21.23 IC3.4
  Bottom 0.406: v37.37,47.75 v40.67,47.75
  Bottom 1.016: v15.91,36.45 14,34.54 14,23.62 v15.27,22.35
+5V  (via drill 0.6)  (1 unrouted)
  Top 0.406: C14.2 33.81,10.13 35.61,11.93 35.61,12.85 R2.2 | R2.2 37.51,14.63 C4.1 | R2.2 37.39,16 | 37.39,16 R4.2 | SERVO.2 69.61,48.53 71.21,46.93 85.59,46.93 R22.2 85.98,46.54 R26.2 85.98,49.1 87.31,50.43 89.57,50.43 R23.2 | MEGA32U4.34 60.41,23.19 v60.48,23.11 60.48,20.96 61.31,20.13 MEGA32U4.24 | v54.13,20.19 54.13,17.65 MEGA32U4.14 | 52.1,26.42 51.99,26.53 MEGA32U4.2 43.73,26.53 v43.72,26.54 | MEGA32U4.44 52.41,26.72 52.1,26.42 | v54.9,22.61 54.82,22.53 | 37.39,16 37.64,16.26 41.43,16.26 42.2,17.02 42.2,19.3 42.83,19.94 v43.34,19.94 | v53.25,25.4 53.12,25.4 52.1,26.42 | v93,23.5 91.9,24.59 91.9,24.7 R33.2 91.37,25.12 90.33,26.16 90.33,27.18 89.06,28.45 86.65,28.45 85.76,27.56 85.76,25.68 R36.2 | 85.76,25.92 R32.2 85.81,25.8 | R1.1 58.03,49.95 v58.01,49.93
  Top 1.016: v35.81,10.13 C14.2 | 25.69,6.69 v25.69,6.86 25.69,5.59 25.43,5.33 IC4.2 | POWER.A 27.88,15.33 v26.96,16.26 26.96,16.76 25.43,18.29 15.84,18.29 C2.1 14.76,17 v14.76,19.68 14.76,19.54 IC3.3 11.36,19.56 D3.C | IC6.14 98.09,31.61 99.09,30.61 v99.09,28.41 v99.1,28.4 | IC7.14 98.7,8.01 98.97,7.75 98.97,4.83 v99.22,4.57 | C4.1 40.21,11.64 42.45,9.4 42.45,7.84 C23.+
  Bottom 0.406: 56.93,23.11 v60.48,23.11 | 56.93,23.11 55.79,21.97 | 56.93,23.11 56.93,24.13 56.67,24.38 54.13,24.38 54.13,24.51 v53.25,25.4 | v54.9,22.61 55.15,22.61 55.79,21.97 | 55.79,21.97 55.79,21.84 v54.13,20.19 | v43.72,26.54 43.72,20.32 v43.34,19.94 | 94.9,23.37 94.62,23.09 | 58.01,51.82 v58.01,49.93
  Bottom 1.016: 26.96,10.13 v35.81,10.13 | v26.96,16.26 26.96,10.13 | 69.3,50.88 68.36,51.82 58.01,51.82 13.62,51.82 9.18,47.37 9.18,25.27 v14.76,19.68 | 69.3,50.88 69.3,49.64 SERVO.2 | 99.1,24.92 105.98,24.92 109.76,28.7 | 109.76,28.7 110.14,29.08 110.01,29.08 110.01,46.48 109.76,46.48 107.73,48.51 107.73,50.93 106.97,51.69 70.11,51.69 69.3,50.88 | 99.1,24.92 v99.1,28.4 | 99.1,24.92 98.23,24.92 96.68,23.37 94.9,23.37 93.12,23.37 v93,23.5 | v25.69,6.86 26.96,6.86 26.96,10.13 | v99.22,4.57 107.98,4.57 110.01,6.6 110.01,28.07 109.76,28.7
+12V  (via drill 0.6)
  Top 0.406: IC6.5 91.11,39.23 | R27.1 69.01,43.43 Q1.3 70.7,42.14 | C7.1 81.69,2.46 81.41,2.18
  Top 1.016: 92.23,39.23 IC6.5 | 92.23,39.23 IC6.20 | 92.11,15.63 IC7.5 | 92.11,15.63 IC7.20 | C21.+ 73.81,16.14 75.22,14.73 75.22,8.95 76.79,8.95 80.01,5.73 80.01,2.39 80.11,2.29 | v92.23,40.89 92.23,39.23 | v92.23,27.18 v92.23,35.81 | v91.47,12.57 91.47,2.67 91.01,2.21 91.01,2.18 81.41,2.18 80.74,2.18 80.38,2.29 80.11,2.29 | v92.23,17.65 92.23,15.76 92.11,15.63 | 31.61,3.68 20.83,3.68 IC4.1 17.41,5.33 16.11,6.63 D7.C | C13.1 33.51,5.58 31.61,3.68 | 80.11,2.29 33,2.29 31.61,3.68 | v73.31,39.53 70.7,42.14
  Bottom 0.406: 92.11,17.53 92.11,17.18 91.85,16.92
  Bottom 1.016: v92.23,35.81 92.23,38.03 | 92.23,38.03 v92.23,40.89 | v92.23,27.18 90.46,25.4 90.46,21.59 91.47,20.57 91.47,18.41 v92.23,17.65 92.11,17.53 92.11,14.73 91.47,14.1 v91.47,12.57 | v73.31,39.53 80.31,39.53 82.91,42.13 88.13,42.13 92.23,38.03
AGND  (via drill 0.6)
  Top 0.406: IC1.3 124.88,11.63 GONDOLA1.1 | G-ICSP.6 133.77,33.09 R17.1 133.99,32.88 134.01,32.88 134.01,27.33 v135.21,26.13 135.21,22.68 C1.- | v122.11,34.03 120.54,34.03 TINY13.4 | R18.1 127.8,17.24 v127.81,17.23 | D2.ANODE 120.91,20.83 C11.2 C12.2 126.31,24.53 v125.51,25.33
  Bottom 0.406: SERV0.1 121.33,39.91 122.31,38.93 122.31,34.23 | 122.31,34.23 v122.11,34.03 | GONDOLA1.1 127.81,14.56 v127.81,17.23 128.31,17.73 128.31,24.13 127.46,24.98 | 122.31,34.23 122.31,30.13 126.01,26.43 | 127.46,24.98 126.01,26.43 | v135.21,26.13 128.61,26.13 127.46,24.98 | v125.51,25.33 125.51,25.93 126.01,26.43
  pour Bottom (isolate 0.254): 119.16,44.64 136.43,44.64 136.43,8.2 119.16,8.2
  pour Top (isolate 0.254): 119.16,44.64 136.43,44.64 136.43,8.2 119.16,8.2
D+
  Top 0.406: R11.1 38.64,22.53 40.49,24.38 48.16,24.38 48.67,24.89 50.57,24.89 MEGA32U4.4
D-
  Top 0.406: R12.1 33.89,25.27 47.4,25.27 47.91,25.78 50.56,25.78 MEGA32U4.3
DIRL  (via drill 0.6)
  Top 0.406: MEGA32U4.25 65.46,20.93 v66.07,20.32 | v80.71,28.45 82.58,28.45 85.76,31.62 87.49,31.62 IC6.11
  Bottom 0.406: v66.07,20.32 66.07,20.57 73.95,28.45 v80.71,28.45
DIRR  (via drill 0.6)
  Top 0.406: v60.36,9.14 60.1,9.4 60.1,12.7 58.81,13.99 MEGA32U4.20 | IC7.11 87.37,7.87 v81.26,7.87
  Bottom 0.406: v60.36,9.14 60.36,9.02 77.92,9.02 79.11,7.83 81.22,7.83 v81.26,7.87
ENABLE
  Top 0.406: R24.2 100.68,31.95 99.7,32.92 96.75,32.92 IC6.15
ENABLER
  Top 0.406: IC7.15 100.57,9.28 R34.2
G-MISO
  Top 0.406: TINY13.6 128.39,35.31 129.11,36.03 129.11,39.57 G-ICSP.1
G-MOSI
  Top 0.406: G-ICSP.4 135.41,40.79 135.41,42.13 134.56,42.98 128.76,42.98 127.49,41.71 SERV0.3 126.01,41.3 126.01,39.73 124.56,38.28 124.56,34.48 125,34.04 TINY13.5
G-PSU
  Top 0.406: D1.C 122.18,17.06 123.51,15.73 133.11,15.73 134.21,16.83 134.21,18.81 IC1.1 133.79,19.23 131.41,19.23 129.81,20.83 C12.1
G-RESET
  Top 0.406: R25.1 126.6,30.32 129.01,32.73 129.01,33.03 | 129.01,33.03 129.01,34.39 G-ICSP.5 | TINY13.1 121.99,37.85 123.81,36.03 123.81,33.73 124.91,32.63 128.61,32.63 129.01,33.03
G-SCK  (via drill 0.6)
  Top 0.406: v125.61,36.53 127.28,36.53 TINY13.7
  Bottom 0.406: G-ICSP.3 126.48,39.15 125.56,38.23 125.56,36.58 v125.61,36.53
GND  (via drill 0.6)
  Top 0.406: 30.71,13.23 30.71,12.73 30.79,12.81 30.79,13.46 | 37.61,7.48 C23.- 37.21,7.33 | 30.71,8.33 30.91,8.28 | C22.- 26.19,20.93 | ICSP.6 50.61,38.64 50.61,39.61 IC2.8 47.28,39.62 40.42,39.62 39.49,38.69 U$1.VSS | MEGA32U4.23 60.81,19.33 59.61,20.53 57.69,20.53 | MEGA32U4.43 53.21,27.09 54.13,26.16 59.47,26.16 | 57.69,20.53 56.12,20.53 54.9,19.3 54.9,17.62 MEGA32U4.15 54.81,16.17 51.85,13.21 51.85,11.17 49.75,9.08 48.53,9.08 RESET.1 | v65.56,33.53 HWB.1 | 26.7,21.44 26.7,25.15 | 26.7,25.15 26.7,25.91 | 26.7,25.91 26.7,27.18 28.6,29.08 C6.2 | 26.7,25.15 26.67,25.18 | 20.22,24.26 R7.2 R3.2 20.1,32.13 20.1,33.15 19.34,33.71 15.15,33.71 14.51,34.54 14.51,39.5 17.94,42.93 RFM12.GND 32.03,42.93 v32.54,42.42 | 59.47,26.16 59.61,26.16 MEGA32U4.35 59.61,31.86 58.96,32.51 58.96,33.27 | 59.47,26.16 58.07,24.77 58.07,23.88 | 58.07,23.88 58.07,20.91 57.69,20.53 | MEGA32U4.5 57.82,24.13 58.07,23.88 | C5.2 26.67,25.94 26.7,25.91 | 58.96,33.27 58.96,35.53 | 58.96,35.53 58.96,36.83 58.45,37.34 58.45,41.02 61.25,43.81 63.91,43.81 65.21,45.11 65.21,48.53 63.79,49.95 R10.1 61.43,51.73 44.98,51.73 U$1.CASE2 43.09,50.84 U$1.CASE3 | 58.96,33.27 v59.21,33.53 | R9.1 29.59,5.91 30.2,6.52 C13.2 | USB.P$5 6.54,29.31 6.54,27.78 6.62,27.71 | v32.54,37.34 32.54,35.55 U$1.CASE1 | Q6.E 63.56,37.68 61.61,35.73 59.16,35.73 58.96,35.53
  Top 1.016: 30.71,12.73 C14.1 30.71,8.33 C13.2 | IC4.3 18.51,12.63 v17.41,13.73 | U$4.P$1 35.62,6.34 36.22,6.34 37.21,7.33 36.26,8.28 30.91,8.28 | C23.- 37.41,7.68 | C3.2 30.81,13.44 30.79,13.46 R15.1 28.81,16.53 28.81,17.7 28.73,17.78 28.48,17.78 26.7,19.56 26.7,20.42 26.19,20.93 | RESET.1 48.29,9.07 48.29,7.62 45.4,4.73 39.81,4.73 39.81,6.08 C23.- | PSU.1 8.03,16.39 | 8.03,16.39 8.15,16.51 11.76,16.51 C2.2 | 1.97,27.71 USB.P$6 6.62,27.71 8.15,27.71 8.15,24.14 | USB.P$9 4.06,33.83 USB.P$7 4.2,33.51 2.19,31.5 2.19,27.93 USB.P$8 | 8.15,24.14 IC3.1 11.36,25.15 19.34,25.15 20.22,24.26 20.35,24.13 22.41,24.13 C22.- | C4.2 37.41,8.48 C23.- | 8.15,24.14 8.15,23.36 7.14,22.35 7.14,17.27 8.03,16.39
  Bottom 0.406: 52.12,37.13 ICSP.6 55.72,33.53 v59.21,33.53 v65.56,33.53 | v17.41,13.73 17.61,13.93 | RESET.1 49.98,7.62 49.98,7.11 55.4,7.11 57.63,4.88 GPIO.1 58.96,4.98 58.96,6.86 59.72,7.62 62.77,7.62 63.95,6.44 GPIO.3 64.04,4.98 64.04,6.86 64.8,7.62 68.87,7.62 69.3,7.19 | v32.54,42.42 v32.54,37.34 | 69.3,7.19 LIMITS.1 | LIMITS.3 74.38,6.36 73.51,7.23 69.34,7.23 69.3,7.19
  Bottom 1.016: PSU.1 5.41,12.99 8.92,16.51 11.97,16.51 14.76,13.72 17.4,13.72 v17.41,13.73
  other vias: 17.3,15.75 20.35,12.45 22.89,12.45 20.35,10.92 20.35,13.97 22.89,13.97 22.89,10.92
  pour Bottom (isolate 0.254): 64.8,46.23 64.8,18.54 68.87,14.48 70.39,14.48 72.68,12.19 72.68,5.33 75.72,2.29 10.19,2.29 3.33,9.14 3.33,21.84 1.3,23.88 1.3,42.93 8.92,50.55 61.75,50.55 64.55,47.75
  pour Top (isolate 0.254): 64.8,46.23 64.8,18.54 68.87,14.48 70.39,14.48 72.68,12.19 72.68,5.33 75.72,2.29 10.19,2.29 3.33,9.14 3.33,21.84 1.3,23.88 1.3,42.93 8.92,50.55 61.75,50.55 64.55,47.75
  pour Bottom (isolate 0.254): 19.08,16.76 24.42,16.76 25.43,15.75 25.43,8.89 24.16,7.62 19.34,7.62 18.07,8.89 18.07,15.75
  pour Top (isolate 0.254): 18.07,15.75 19.08,16.76 24.42,16.76 25.43,15.75 25.43,8.89 24.16,7.62 19.34,7.62 18.07,8.89
GNDA  (via drill 0.6)
  Top 0.406: IC6.19 96.74,37.92 98.7,37.92 99.52,38.75 R19.1 100.12,38.72 v102.1,38.72 | R29.1 99.92,15.15 98.9,14.12 97.7,14.12 | 97.7,14.12 96.94,14.12 | 96.94,14.12 IC7.19 | 93.25,14.36 93.7,14.36 93.9,14.16 | 97.47,14.36 97.7,14.12 | 96.94,14.12 96.7,14.12 | C18.2 97.5,48.12 97.5,49.92 105.72,49.92 R20.1 105.5,48.12 v102.5,45.12 | 97.3,26.43 97.3,26.72 100.92,26.72 101.89,27.69 | 101.68,29.52 R24.1 101.89,29.32 101.89,27.69 | IC6.7 87.54,36.72 | 101.12,5.88 R34.1 101.3,3.99 100.62,3.3 96.68,3.3 92.62,7.37 92.62,14.36 | R31.1 80.49,19.05 | R21.1 82.31,36.93 C17.2 | R30.1 105.92,26.19 104.74,27.37 | 104.74,27.37 104.43,27.69 101.89,27.69 | 97.3,26.43 C20.2 | 97.3,26.43 94.77,28.96 94.77,36.43 95.03,36.69 IC6.18 | 73.06,33.4 75.47,35.81 75.47,38.73 79.03,42.29 79.28,42.29 C8.2 | C9.2 80.55,23.62 81.95,22.23 81.95,19.84 C19.2 83.06,18.75 80.83,18.75 R31.1 | R31.1 80.2,18.7 79.15,17.65 79.15,14.35 79.92,13.59 v81.06,13.59 | 104.74,27.37 105.06,27.69
  Top 1.016: IC6.18 IC6.19 96.59,37.85 88.42,37.85 87.54,36.96 87.54,36.72 | IC6.6 IC6.7 87.36,36.83 85.12,36.83 85.12,36.58 83.6,35.05 81.44,35.05 R8.1 | IC7.6 92.62,14.36 93.25,14.36 | 93.7,14.36 97.47,14.36 | 96.7,14.12 IC7.18 | IC7.6 IC7.7 | 76.3,30.67 C21.- 76.59,25.4 v76.99,25.4 | 76.3,30.67 76.3,32.58 78.96,32.58 R8.1 | 76.3,30.67 75.79,30.67 73.06,33.4 72.68,33.78 70.39,33.78 v67.85,36.32 | R34.1 101.38,5.75 | C7.2 86.65,4.57 v86.9,4.32 | IC7.6 83.71,14.36 R28.1 81.14,13.67 v81.06,13.59 | 82.31,36.93 82.31,35.92 R8.1
  Bottom 0.406: v102.5,45.12 102.5,39.12 v102.1,38.72
  Bottom 1.016: GONDOLA.2 SERVO.1 72.15,40.62 v67.85,36.32 | U$4.P$2 38.27,2.29 83.19,2.29 83.19,5.59 | v76.99,25.4 80.8,21.59 80.8,14.48 81.06,14.22 v81.06,13.59 81.06,10.92 83.19,8.79 83.19,5.59 | v86.9,4.32 84.46,4.32 83.19,5.59
  pour Top (isolate 0.254): 110.27,51.56 67.34,51.56 67.34,18.54 71.41,18.54 79.28,10.67 79.28,4.32 81.31,2.29 105.95,2.29 112.05,8.38 112.05,49.78
  pour Bottom (isolate 0.254): 110.27,51.56 67.34,51.56 67.34,18.54 71.41,18.54 79.28,10.67 79.28,4.32 81.31,2.29 105.95,2.29 112.05,8.38 112.05,49.78
GONDOLALED
  Top 0.406: TINY13.3 122.72,35.32 123.06,34.98 123.06,32.98 122.31,32.23 122.31,31.82 LED.A
GONDOLAOUT  (via drill 0.6)
  Top 1.016: Q1.2 73.01,42.13 74.01,41.13 76.21,41.13 77.61,42.53 v77.61,43.93
  Bottom 1.016: v77.61,43.93 77.61,46.66 79.08,46.66 79.92,47.75 79.92,49.22 GONDOLA.1
GPIO1  (via drill 0.6)
  Top 0.406: GPIO.4 66.33,11.68 v64.8,13.21 | MEGA32U4.26 66.95,21.73 v68.36,20.32
  Bottom 0.406: v64.8,13.21 68.36,16.76 v68.36,20.32
GPIO2  (via drill 0.6)
  Top 0.406: v70.26,21.46 69.2,22.53 MEGA32U4.27 | GPIO.2 61.25,7.11 63.53,9.4 63.53,11.81 v63.66,11.94
  Bottom 0.406: v70.26,21.46 70.26,17.02 65.18,11.94 v63.66,11.94
LIMITL  (via drill 0.6)
  Top 0.406: MEGA32U4.31 64.37,25.73 65.06,26.42 v65.06,27.18 | v65.31,17.02 74.7,7.63 75.61,7.63 76.92,6.32 LIMITS.4
  Bottom 0.406: v65.06,27.18 65.06,24.89 64.55,24.38 64.55,17.78 v65.31,17.02
LIMITR  (via drill 0.6)
  Top 0.406: MEGA32U4.32 63.39,26.53 v63.79,26.92 | LIMITS.2 71.84,8.46 v64.8,15.49
  Bottom 0.406: v63.79,26.92 63.79,16.51 v64.8,15.49
MISO  (via drill 0.6)
  Top 0.406: MEGA32U4.11 v47.01,19.33 47.01,16.43 MISO.TP | RFM12.SDO 11.84,50.93 v17.81,44.96 | U$1.DAT0 40.67,35.52 v40.67,38.1 42.2,38.1 45.64,34.66 ICSP.1
  Bottom 0.406: ICSP.1 46.97,19.37 v47.01,19.33 | v17.81,44.96 17.81,44.7 28.23,34.29 30,34.29 33.05,31.24 39.4,31.24 40.67,32.51 v40.67,38.1
MOSI  (via drill 0.6)
  Top 0.406: IC2.5 50.84,45.09 51.61,44.33 v51.61,39.82 | MEGA32U4.10 50.55,20.07 48.67,20.07 48.41,20.33 v44.81,20.33 44.81,17.93 MOSI.TP
  Bottom 0.406: v44.81,20.33 44.81,38.13 45.81,39.13 48.01,39.13 49.51,37.63 ICSP.4 51.61,39.3 v51.61,39.82
MOSI_3.3  (via drill 0.6)
  Top 0.406: RFM12.SDI 36.1,46.93 v36.1,43.69 | v36.1,38.61 36.19,38.61 U$1.CMD | IC2.4 46.65,46.36 44.48,44.2 40.42,44.2 v39.91,43.69
  Bottom 0.406: v36.1,38.61 v36.1,43.69 v39.91,43.69
MOTORSUPPLY
  Bottom 1.016: STEPL.5 STEPL.6
MOTORSUPPLY1
  Top 1.016: STEPR.5 STEPR.6
MS1
  Top 0.406: MEGA32U4.28 62.25,23.37 69.63,23.37 71.28,25.02 71.41,24.89 75.47,24.89 76.11,24.26 | 76.11,24.26 76.49,23.88 78.52,23.88 78.52,26.16 78.77,26.42 81,26.42 82.31,27.73 83.64,27.73 86.25,30.34 IC6.12 | 76.11,24.26 75.98,24.13 75.98,17.53 76.23,17.27 76.23,10.26 77.19,10.26 80.81,6.63 87.39,6.63 IC7.12
MS2  (via drill 0.6)
  Top 0.406: MEGA32U4.29 67.09,24.13 v68.1,25.15 | IC7.13 95.15,6.74 93.76,8.13 v93.76,11.18 | v96.81,29.21 96.81,30.23 IC6.13
  Bottom 0.406: v68.1,25.15 68.87,25.15 74.2,30.48 83.34,30.48 85.88,27.94 90.46,27.94 90.96,28.45 93.76,28.45 | 93.76,28.45 96.04,28.45 v96.81,29.21 | v93.76,11.18 93.76,20.32 91.6,22.48 91.6,24.77 93.76,26.92 93.76,28.45
N$1  (via drill 0.6)
  Top 0.406: v63.21,45.33 R10.2 | 63.21,29.21 63.21,28.33 MEGA32U4.33 | HWB.2 64.48,30.48 63.21,29.21 | 63.21,29.21 v63.21,35.26
  Bottom 0.406: v63.21,35.26 v63.21,45.33
N$3  (via drill 0.6)
  Top 0.406: RADIO_ACT.A 28.7,35.43 v29.24,35.98 | v57.18,43.69 57.18,44.7 56.67,45.21 55.2,45.21 IC2.12
  Bottom 0.406: v29.24,35.98 29.24,41.15 33.81,45.72 50.32,45.72 52.1,43.94 56.93,43.94 v57.18,43.69
N$4  (via drill 0.6)
  Top 0.406: GONDOLA1.2 120.94,13.02 D1.A 125.36,14.26 R18.2 | R16.1 123.63,25.35 v123.61,25.33
  Bottom 0.406: v123.61,25.33 123.61,12.9 GONDOLA1.2
N$5
  Top 0.406: IC2.10 55.11,42.53 56.81,42.53 56.85,41.98 56.85,40.05 55.16,38.35 55.16,33.28 53.41,31.53 46.41,31.53 44.79,33.15 SD_ACT.A
N$6  (via drill 0.6)
  Top 0.406: 14.89,32 8.79,32 8.03,31.24 4.68,31.24 USB.P$2 | 14.89,32 R3.1 | R12.2 28.98,25.53 v28.35,26.16 | v15.4,30.86 15.4,31.5 14.89,32
  Bottom 0.406: v28.35,26.16 20.1,26.16 v15.4,30.86
N$7
  Top 0.406: R15.2 STATUS.C | R15.2 33.63,15.91 33.81,15.73 33.81,16.35 R15.2
N$8
  Top 0.406: C3.1 33.61,14.33 34.41,14.33 35.41,15.33 35.41,19.33 37.01,20.93 38.39,20.93 40.79,23.33 MEGA32U4.6
N$9
  Top 0.406: RFM12.ANT 24.01,38.93 ANT.1
N$10  (via drill 0.6)
  Top 0.406: MEGA32U4.16 55.66,17.48 55.66,14.99 54.9,14.22 v54.64,14.22 | Q4.1 27.53,32.19 29.75,29.97 33.31,29.97 34.07,30.73 37.03,30.73 C6.1 41.56,29.08 v41.69,28.96
  Bottom 0.406: v54.64,14.22 47.28,14.22 37.88,23.62 37.88,25.15 v41.69,28.96
N$11  (via drill 0.6)
  Top 0.406: MEGA32U4.17 56.41,13.71 v55.91,13.21 | v29.5,32.51 28.23,33.68 25.69,33.68 24.67,32.77 24.67,31.24 23.22,29.79 Q4.3 22.47,26.06 C5.1
  Bottom 0.406: v55.91,13.21 46.9,13.21 29.37,30.73 29.37,32.38 v29.5,32.51
N$12  (via drill 0.6)
  Top 0.406: USB.P$3 13.49,30.61 14.89,29.21 15.02,29.21 | 15.02,29.21 R7.1 | R11.2 29.57,22.53 v28.35,23.75 | v15.4,28.19 15.4,28.83 15.02,29.21
  Bottom 0.406: v28.35,23.75 19.84,23.75 v15.4,28.19
N$13
  Top 0.406: R9.2 POWER.C
N$14
  Top 1.016: PSU.3 12.95,12.99 14.26,11.68 16.03,11.68 D7.A
N$15
  Top 0.406: R5.2 RADIO_ACT.C
N$18
  Top 0.406: R6.2 SD_ACT.C
N$22
  Top 0.406: R8.2 81.98,32.16 83.6,33.78 84.23,33.78 85.88,35.43 87.49,35.43 IC6.8
N$23
  Top 0.406: R19.2 99.08,35.9 98.5,35.32 96.8,35.32 IC6.17
N$24
  Top 0.406: R21.2 82.31,39.78 C17.1 83.09,40.52 83.09,40.89 85.23,43.04 IC6.2
N$25
  Top 0.406: R20.2 C18.1 100.1,44.32 98.9,43.12 96.79,43.12 IC6.23
N$26  (1 unrouted)
  Top 0.406: IC7.8 83.73,11.82 82.96,11.05
N$27
  Top 0.406: R29.2 99.08,12.3 98.5,11.72 96.8,11.72 IC7.17
N$28
  Top 0.406: C19.1 83.24,16.49 | IC7.2 86.02,19.44 85.12,18.54 85.12,16.76 84.23,15.88 83.12,15.88 C19.1 | R31.2 82.99,15.85 C19.1
N$29
  Top 0.406: IC7.23 96.79,19.52 99.3,19.52 100.1,20.32 C20.1 R30.2
N$34
  Top 0.406: R17.2 131.04,32.26 127.71,28.93 124.01,28.93 123.91,29.03 123.91,30.38 LED.C
OUT1A
  Top 0.406: 107.17,38.92 STEPL.4
  Top 1.016: 107.17,38.92 104.7,38.92 103.9,38.12 103.9,36.72 101.33,34.15 IC6.16
OUT1B  (via drill 0.6)
  Top 0.406: 103.73,40.5 v103.9,40.32
  Top 1.016: IC6.21 103.73,40.5
  Bottom 0.406: 107.17,36.12 STEPL.3
  Bottom 1.016: v103.9,40.32 103.9,37.52 105.3,36.12 107.17,36.12
OUT2A  (via drill 0.6)
  Top 0.406: 89.55,34.15 v89.69,34.29
  Top 1.016: IC6.9 89.55,34.15
  Bottom 0.406: 107.09,33.92 STEPL.2
  Bottom 1.016: 107.09,33.92 90.54,33.92 90.18,34.29 v89.69,34.29
OUT2B  (via drill 0.6)
  Top 0.406: v84.7,40.52 84.73,40.5
  Top 1.016: 84.73,40.5 IC6.4
  Bottom 0.406: 107.25,31.12 STEPL.1
  Bottom 1.016: v84.7,40.52 84.7,36.72 83.1,35.12 83.1,32.52 84.5,31.12 107.25,31.12
OUT3A
  Top 0.406: IC7.16
  Top 1.016: STEPR.4 104.31,14.99 102.65,13.34 102.65,11.68 101.5,10.54 IC7.16
OUT3B
  Top 0.406: 107.83,12.45 STEPR.3 | IC7.21 96.93,16.87
  Top 1.016: 107.83,12.45 109.7,14.32 109.7,21.12 108.5,22.32 106.1,22.32 103.9,20.12 103.9,17.47 103.3,16.87 96.93,16.87
OUT4A  (via drill 0.6)
  Top 0.406: 87.33,10.72 IC7.9
  Top 1.016: IC7.9 v90.08,10.54
  Bottom 1.016: STEPR.2 90.7,9.91 v90.08,10.54
OUT4B  (via drill 0.6)
  Top 0.406: 87.62,17.02 IC7.4
  Top 1.016: v90.33,17.02 87.62,17.02
  Bottom 1.016: STEPR.1 89.94,7.37 87.53,9.78 87.53,14.22 v90.33,17.02
PFD
  Top 0.406: R23.1 94.72,46.29 IC6.24
PFDR
  Top 0.406: IC7.24 96.7,20.72 94.3,23.12 94.3,25.1 R33.1
PWML  (via drill 0.6)
  Top 0.406: MEGA32U4.30 62.25,24.89 65.31,24.89 v66.07,25.65 | R13.2 77.39,35.29 77.15,35.05 76.49,34.39 v76.49,34.29
  Bottom 0.406: v66.07,25.65 66.07,27.94 67.47,29.34 71.53,29.34 v76.49,34.29
PWMLFILTER
  Top 0.406: IC6.1 86,44.31 85.38,43.69 83.47,43.69 C8.1 | R13.1 78.26,40.39 79.03,41.15 80.93,41.15 C8.1 | PWML.TP 81.41,43.72 C8.1
PWMR  (via drill 0.6)
  Top 0.406: v49.31,17.27 52.15,17.27 MEGA32U4.12 | v76.99,19.05 78.62,19.05 R14.2
  Bottom 0.406: 51.09,19.05 v49.31,17.27 49.69,16.89 57.18,16.89 59.09,14.99 59.09,13.72 61.88,10.92 66.2,10.92 74.33,19.05 v76.99,19.05
PWMRFILTER
  Top 0.406: IC7.1 83.62,20.71 R14.1 83.35,20.98 C9.1 83.31,24.55 PWMR.TP
Q6BASE
  Top 0.406: Q6.B 62.76,39.58 R35.1
Q6COLLECTOR
  Top 0.406: Q6.C 67.01,39.63 65.01,41.63 R27.2 65.01,43.23 67.11,45.33 74.61,45.33 75.41,44.53 75.41,43.52 Q1.1
RESET  (via drill 0.6)
  Top 0.406: v53.21,21.55 MEGA32U4.13 53.21,15.53 52.31,14.63 44.21,14.63 | 44.21,14.63 R2.1 | v44.01,13.33 44.01,14.43 44.21,14.63
  Bottom 0.406: ICSP.5 52.05,23.09 v53.21,21.55 | RESET.3 47.07,4.67 44.01,7.73 v44.01,13.33
RESETL
  Top 0.406: IC6.22 95.07,41.77 90.41,46.43 90.41,48.13 89.81,48.73 88.92,48.73 R26.1
RESETR
  Top 0.406: IC7.22 93.95,18.17 93.95,19.36 90.2,23.11 90.2,24.08 R36.1
RF12_SEL_3.3  (via drill 0.6)
  Top 0.406: v17.21,49.53 18.17,49.53 18.39,49.31 20.01,50.93 RFM12.SEL 26.57,50.93 v27.46,50.04 | R5.1 18.39,38.68 v18.45,38.73 | v52.36,48.77 54.95,48.77 IC2.15
  Bottom 0.406: v17.21,49.53 17.01,49.73 13.81,49.73 12.61,48.53 12.61,45.53 12.61,45.52 12.61,42.67 16.54,38.73 v18.45,38.73 | v27.46,50.04 51.09,50.04 v52.36,48.77
RF12INT  (via drill 0.6)
  Top 0.406: RFM12.IRQ 11.21,48.93 v15.01,45.13 | MEGA32U4.18 57.21,11.71 v57.05,11.56
  Bottom 0.406: 15.21,45.13 v15.01,45.13 18.7,41.44 18.7,40.39 47.53,11.56 v57.05,11.56
RFM12_SEL  (via drill 0.6)  (1 unrouted)
  Top 0.406: 55.79,47.63 IC2.14 | 55.79,47.63 56.28,47.63 | 54.9,30.73 54.9,28.96 | v43.47,30.73 54.9,30.73 | 55.79,47.63 55.8,47.62 56.93,47.62 58.33,46.23 58.33,42.93 57.82,42.42 57.69,42.42 57.69,39.62 55.91,37.85 55.91,32.77 54.9,31.75 54.9,30.73 | R4.1 40.23,20.39 41.18,21.34 v42.7,21.34
  Bottom 0.406: v42.7,21.34 42.7,30.1 v43.47,30.73
SCK  (via drill 0.6)
  Top 0.406: MEGA32U4.9 49.21,20.93 48.81,21.33 v48.01,21.33 | 53.26,41.28 IC2.9 | 53.26,41.28 52.41,42.13 52.41,43.33 53.01,43.93 | 53.01,43.93 54.98,43.93 IC2.11 | 53.26,41.28 53.26,39.28 54.21,38.33 54.21,33.73 53.01,32.53 51.21,32.53 50.21,33.53 50.21,33.96 ICSP.3 | IC2.3 50.91,47.63 53.01,45.53 53.01,43.93 | SCK.TP 49.51,29.03 v49.51,29.13
  Bottom 0.406: ICSP.3 49.51,31.63 48.01,30.13 48.01,29.13 | v48.01,21.33 48.01,28.73 48.01,29.13 | 48.01,29.13 v49.51,29.13
SCK_3.3
  Top 0.406: RFM12.SCK 38.39,48.93 38.39,46.74 | 38.39,46.74 U$1.CLK | IC2.2 46.91,48.9 46.91,48.4 44.99,46.48 38.64,46.48 38.39,46.74
SD_SEL  (via drill 0.6)
  Top 0.406: v46.26,41.4 46.26,41.53 47.28,42.54 48.93,42.54 IC2.7 | MEGA32U4.40 55.61,31.45 56.67,32.51 56.67,35.81 v56.93,36.07 | v60.21,45.23 R1.2
  Bottom 0.406: 56.67,37.85 55.66,37.85 52.1,41.4 v46.26,41.4 | 56.67,37.85 56.93,37.85 57.56,38.48 57.56,41.66 58.58,42.67 58.58,43.6 v60.21,45.23 | v56.93,36.07 56.93,37.59 56.67,37.85
SD_SEL_3.3  (via drill 0.6)
  Top 0.406: U$1.DAT3 v35.08,37.34 | U$1.DAT3 | v46.26,43.94 48.82,43.94 IC2.6 | U$1.DAT3 35.08,33.85 R6.1
  Bottom 0.406: v35.08,37.34 35.34,37.08 36.86,37.08 40.42,40.64 42.96,40.64 v46.26,43.94
SERVO  (via drill 0.6)
  Top 0.406: MEGA32U4.39 56.41,31.03 57.81,32.43 v57.81,34.63 | R35.2 61.21,41.63 v62.21,42.63
  Bottom 0.406: v57.81,34.63 57.81,34.73 61.21,38.13 61.21,43.93 | 61.21,43.93 61.21,47.83 62.61,49.23 66.97,49.23 SERVO.3 | v62.21,42.63 62.21,42.93 61.21,43.93
SIG
  Top 0.406: 120.47,36.53 TINY13.2 120.42,36.48 119.56,36.48 119.11,36.03 119.11,28.23 120.01,27.33 R16.2 120.79,23.65 D2.CATHODE
SLEEP
  Top 0.406: IC6.3 89.45,41.77 90.21,42.53 90.21,45.15 R22.1
SLEEPR
  Top 0.406: IC7.3 88.69,18.17 89.82,19.3 89.82,20.83 88.69,21.96 R32.1
STATUS_LED  (via drill 0.6)
  Top 0.406: v30.26,27.18 30.51,27.43 36.48,27.43 37.75,26.16 41.56,26.16 43.09,27.69 44.74,27.69 45.12,27.3 50.59,27.3 MEGA32U4.1 | v29.24,19.3 30.56,19.3 STATUS.A
  Bottom 0.406: v30.26,27.18 30.26,20.32 v29.24,19.3
STEPL  (via drill 0.6)
  Top 0.406: MEGA32U4.21 59.72,17.53 59.72,16.26 59.98,16 62.52,16 65.31,18.8 69.37,18.8 71.66,21.08 v71.66,21.34 | IC6.10 87.39,32.77 85.38,32.77 82.71,30.1 80.55,30.1 79.03,28.57 v79.03,27.43
  Bottom 0.406: v71.66,21.34 71.66,22.1 76.74,27.18 78.77,27.18 v79.03,27.43
STEPR  (via drill 0.6)
  Top 0.406: v58.71,11.18 58.71,12.7 57.94,13.46 57.94,17.46 MEGA32U4.19 | 87.37,9.14 IC7.10 v79.79,9.27
  Bottom 0.406: v58.71,11.18 60.48,11.18 61.5,10.16 78.9,10.16 v79.79,9.27
VBUS  (via drill 0.6)
  Top 0.406: MEGA32U4.7 41.1,22.53 38.13,19.56 v37.5,19.56 | v6.26,33.27 5.75,33.27 5.75,32.13 5.49,31.88 4.7,31.88 USB.P$1
  Top 1.016: D3.A 5.02,24.04 v5.37,24.38
  Bottom 0.406: v37.5,19.56 33.05,19.56 31.27,17.78 7.27,17.78 6.76,18.29 6.76,24.89 6.76,32.77 v6.26,33.27
  Bottom 1.016: v5.37,24.38 6.26,24.38 6.76,24.89
VSS  (via drill 0.6)
  Top 0.406: 130.91,29.73 130.91,30.23 | 130.91,29.73 130.91,29.58 | TINY13.8 127.33,39.65 v128.81,41.13 | C11.1 124.11,20.43 124.11,19.53 124.71,18.93 IC1.2 129.61,18.85 v129.61,16.73 | 129.41,27.48 R25.2 126.18,27.36 v129.51,24.03 | 129.41,27.48 130.31,27.48 C1.+ 131.46,29.18 130.91,29.73 | v129.51,28.83 129.51,27.57 129.41,27.48
  Bottom 0.406: v128.81,41.13 128.81,43.23 128.31,43.73 124.51,43.73 123.87,43.09 SERV0.2 123.87,34.47 v129.51,28.83 | v129.51,24.03 129.51,16.83 v129.61,16.73

### Text on the board
tPlace: v4.2 2013
tNames: gnd | mattvenn.net | gnd | 1 | 1 | gnd | 1 | gnd | 2 | gnd | R | gnd | L | - | + | 12VDC centre+
bNames: polargraph controller v4.2 | http://bit.ly/mPysmJ